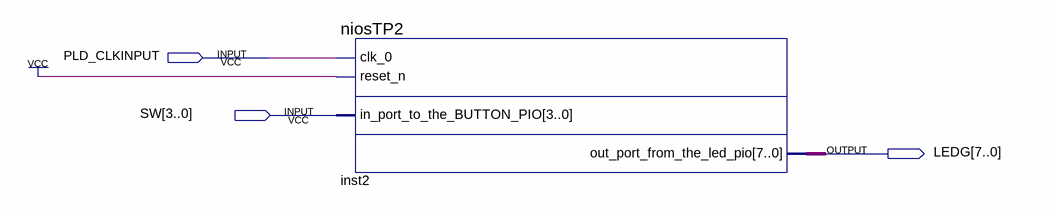
[diagram p0: schematic sheet]
// Quartus schematic TP2.bdf as structural Verilog: 1 symbols, 3 pins
module TP2 (
  input  PLD_CLKINPUT,
  input  [3:0] SW,
  output [7:0] LEDG
);

  niosTP2 inst2 (
    .clk_0(PLD_CLKINPUT), .reset_n(1'b1), .in_port_to_the_BUTTON_PIO(SW), .out_port_from_the_led_pio(LEDG));
endmodule
